# EasyEDA schematic SCH_Project_2026-06-06.json
TITLE: Sheet_1; REV: 1.0; Date: 2026-05-03; Sheet: 1/1; Company: Your Company
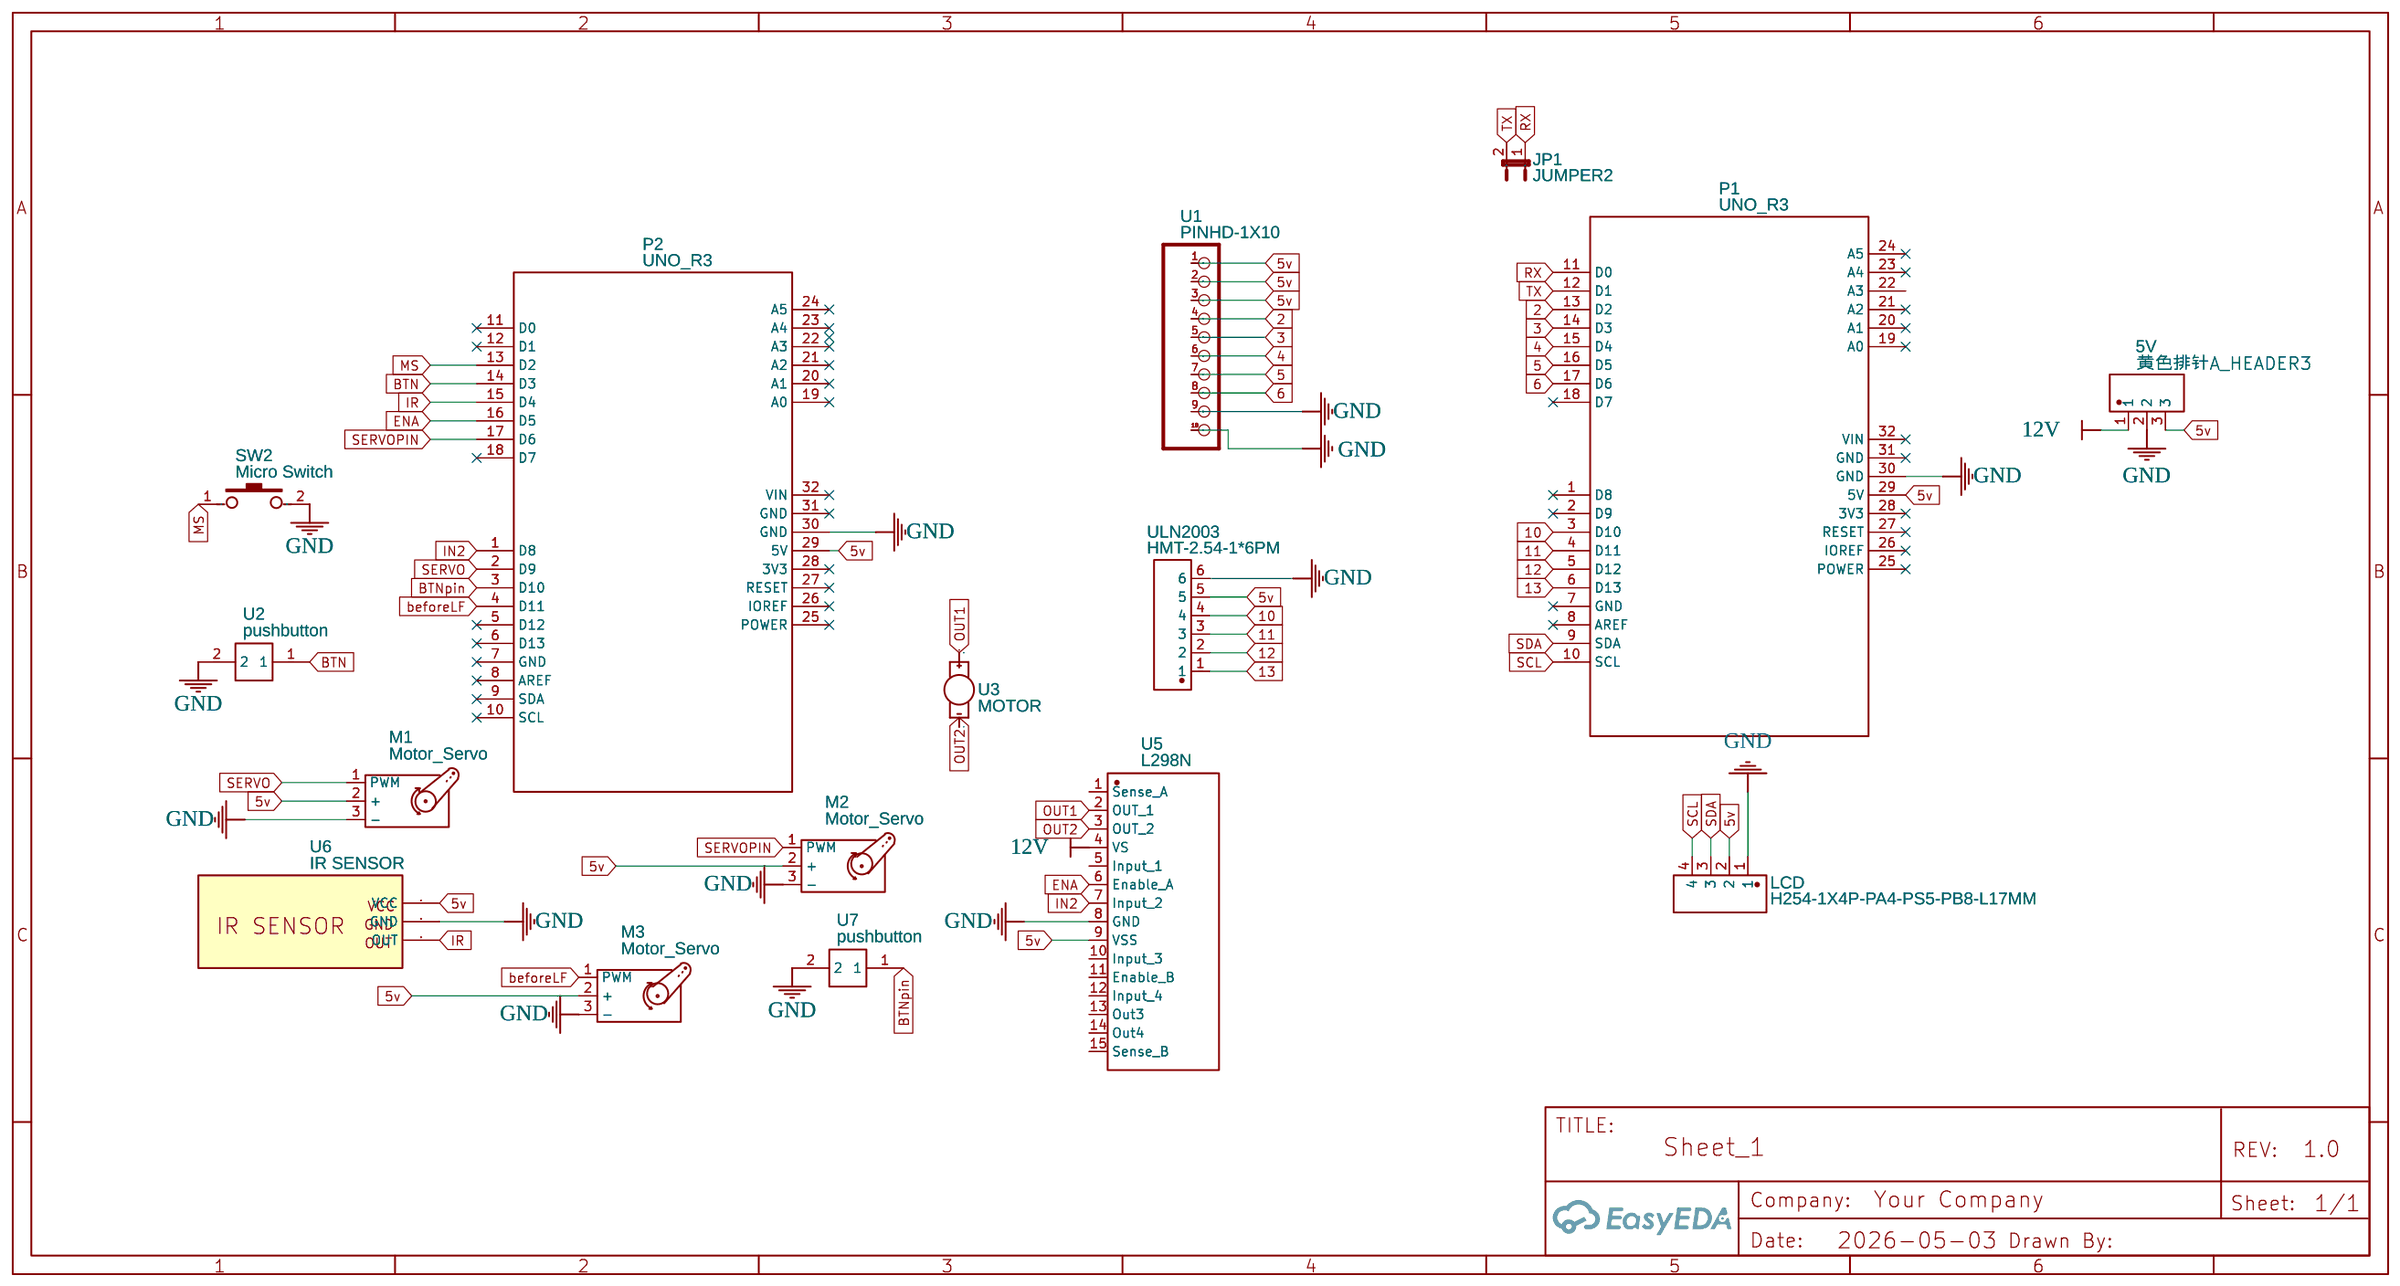
[diagram p0: schematic sheet]

## Parts
5V  黄色排针A_HEADER3  [HDR-TH_3P-P2.54-V-M-1]
JP1  JUMPER2  [JUMPER2]
LCD  H254-1X4P-PA4-PS5-PB8-L17MM  [HDR-TH_4P-P2.54-V-M_H254-1X4P]
M1  Motor_Servo
M2  Motor_Servo
M3  Motor_Servo
P1  UNO_R3  [UNO_R3]
P2  UNO_R3  [UNO_R3]
SW2  Micro Switch  [MICRO-SWITCH-THT]
U1  PINHD-1X10  [1X10-BIG]
U2  pushbutton  [PUSHBUTTON]
U3  MOTOR  [VIBE-MOTOR-10MM]
U5  L298N  [MULTIWATT-15_L19.6-W5.0-P1.27-L]
U6  IR SENSOR  [MH-SENSOR-SERIES-LINE-SENSOR]
U7  pushbutton  [PUSHBUTTON]
ULN2003  HMT-2.54-1*6PM  [HDR-TH_HMT-2.54-1X6PM]

## Library data of the parts
5V = 黄色排针A_HEADER3: Contributor: lcsc; Supplier: LCSC; Supplier Part: C9900019266; Manufacturer: null; JLCPCB Part Class: Extended Part
JP1 = JUMPER2: Jumper 2 Pin; Contributor: PatternAgents
LCD = H254-1X4P-PA4-PS5-PB8-L17MM: Supplier: LCSC; Supplier Part: C9900152087; Manufacturer: null; JLCPCB Part Class: Extended Part; Contributor: lcsc
M1-M3 = Motor_Servo: Contributor: KiCAD; license: https://www.gnu.org/licenses/lgpl-2.1.html
P1 P2 = UNO_R3: sourceId: 1T5FDZYC8
SW2 = Micro Switch: Contributor: wolfezrawilliam
U1 = PINHD-1X10: Contributor: Adafruit
U2 U7 = pushbutton: Contributor: super7800
U3 = MOTOR: Contributor: SparkFun
U5 = L298N: Contributor: LCSC; Supplier: LCSC; Supplier Part: C434589; Manufacturer: HGSEMI(华冠); JLCPCB Part Class: Extended Part
U6 = MH-Sensor-Series Line Sensor: Contributor: guoyuhui
ULN2003 = HMT-2.54-1*6PM: Supplier: LCSC; Supplier Part: C54620385; Manufacturer: HMTCONN(华明通); Contributor: lcsc; JLCPCB Part Class: Extended Part

## Nets
5v: 5V.3 LCD.2 M1.2(+) M2.2(+) M3.2(+) P1.29(5V) P2.29(5V) U1.1 U1.2 U1.3 U5.9(VSS) U6.4(VCC) ULN2003.5
12V: 5V.1 U5.4(VS)
GND: 5V.2 LCD.1 M1.3(-) M2.3(-) M3.3(-) P1.30(GND) P2.30(GND) SW2.2 U1.9 U1.10 U2.2 U5.8(GND) U6.3(GND) U7.2 ULN2003.6
2: P1.13(D2) U1.4
3: P1.14(D3) U1.5
4: P1.15(D4) U1.6
5: P1.16(D5) U1.7
6: P1.17(D6) U1.8
10: P1.3(D10) ULN2003.4
11: P1.4(D11) ULN2003.3
12: P1.5(D12) ULN2003.2
13: P1.6(D13) ULN2003.1
beforeLF: M3.1(PWM) P2.4(D11)
BTN: P2.14(D3) U2.1
BTNpin: P2.3(D10) U7.1
ENA: P2.16(D5) U5.6(Enable A)
IN2: P2.1(D8) U5.7(Input 2)
IR: P2.15(D4) U6.2(OUT)
MS: P2.13(D2) SW2.1
OUT1: U3.+ U5.2(OUT 1)
OUT2: U5.3(OUT 2)
RX: JP1.1 P1.11(D0)
SCL: LCD.4 P1.10(SCL)
SDA: LCD.3 P1.9(SDA)
SERVO: M1.1(PWM) P2.2(D9)
SERVOPIN: M2.1(PWM) P2.17(D6)
TX: JP1.2 P1.12(D1)

Not connected (* = marked no-connect by the designer): P1 1(D8)* 2(D9)* 7(GND)* 8(AREF)* 18(D7)* 19(A0)* 20(A1)* 21(A2)* 22(A3) 23(A4)* 24(A5)* 25(POWER)* 26(IOREF)* 27(RESET)* 28(3V3)* 31(GND)* 32(VIN)*; P2 5(D12)* 6(D13)* 7(GND)* 8(AREF)* 9(SDA)* 10(SCL)* 11(D0)* 12(D1)* 18(D7)* 19(A0)* 20(A1)* 21(A2)* 22(A3)* 23(A4)* 24(A5)* 25(POWER)* 26(IOREF)* 27(RESET)* 28(3V3)* 31(GND)* 32(VIN)*; U3 -; U5 1(Sense A) 5(Input 1) 10(Input 3) 11(Enable B) 12(Input 4) 13(Out3) 14(Out4) 15(Sense B)
